# EAGLE schematic motor (EAGLE 4.16)
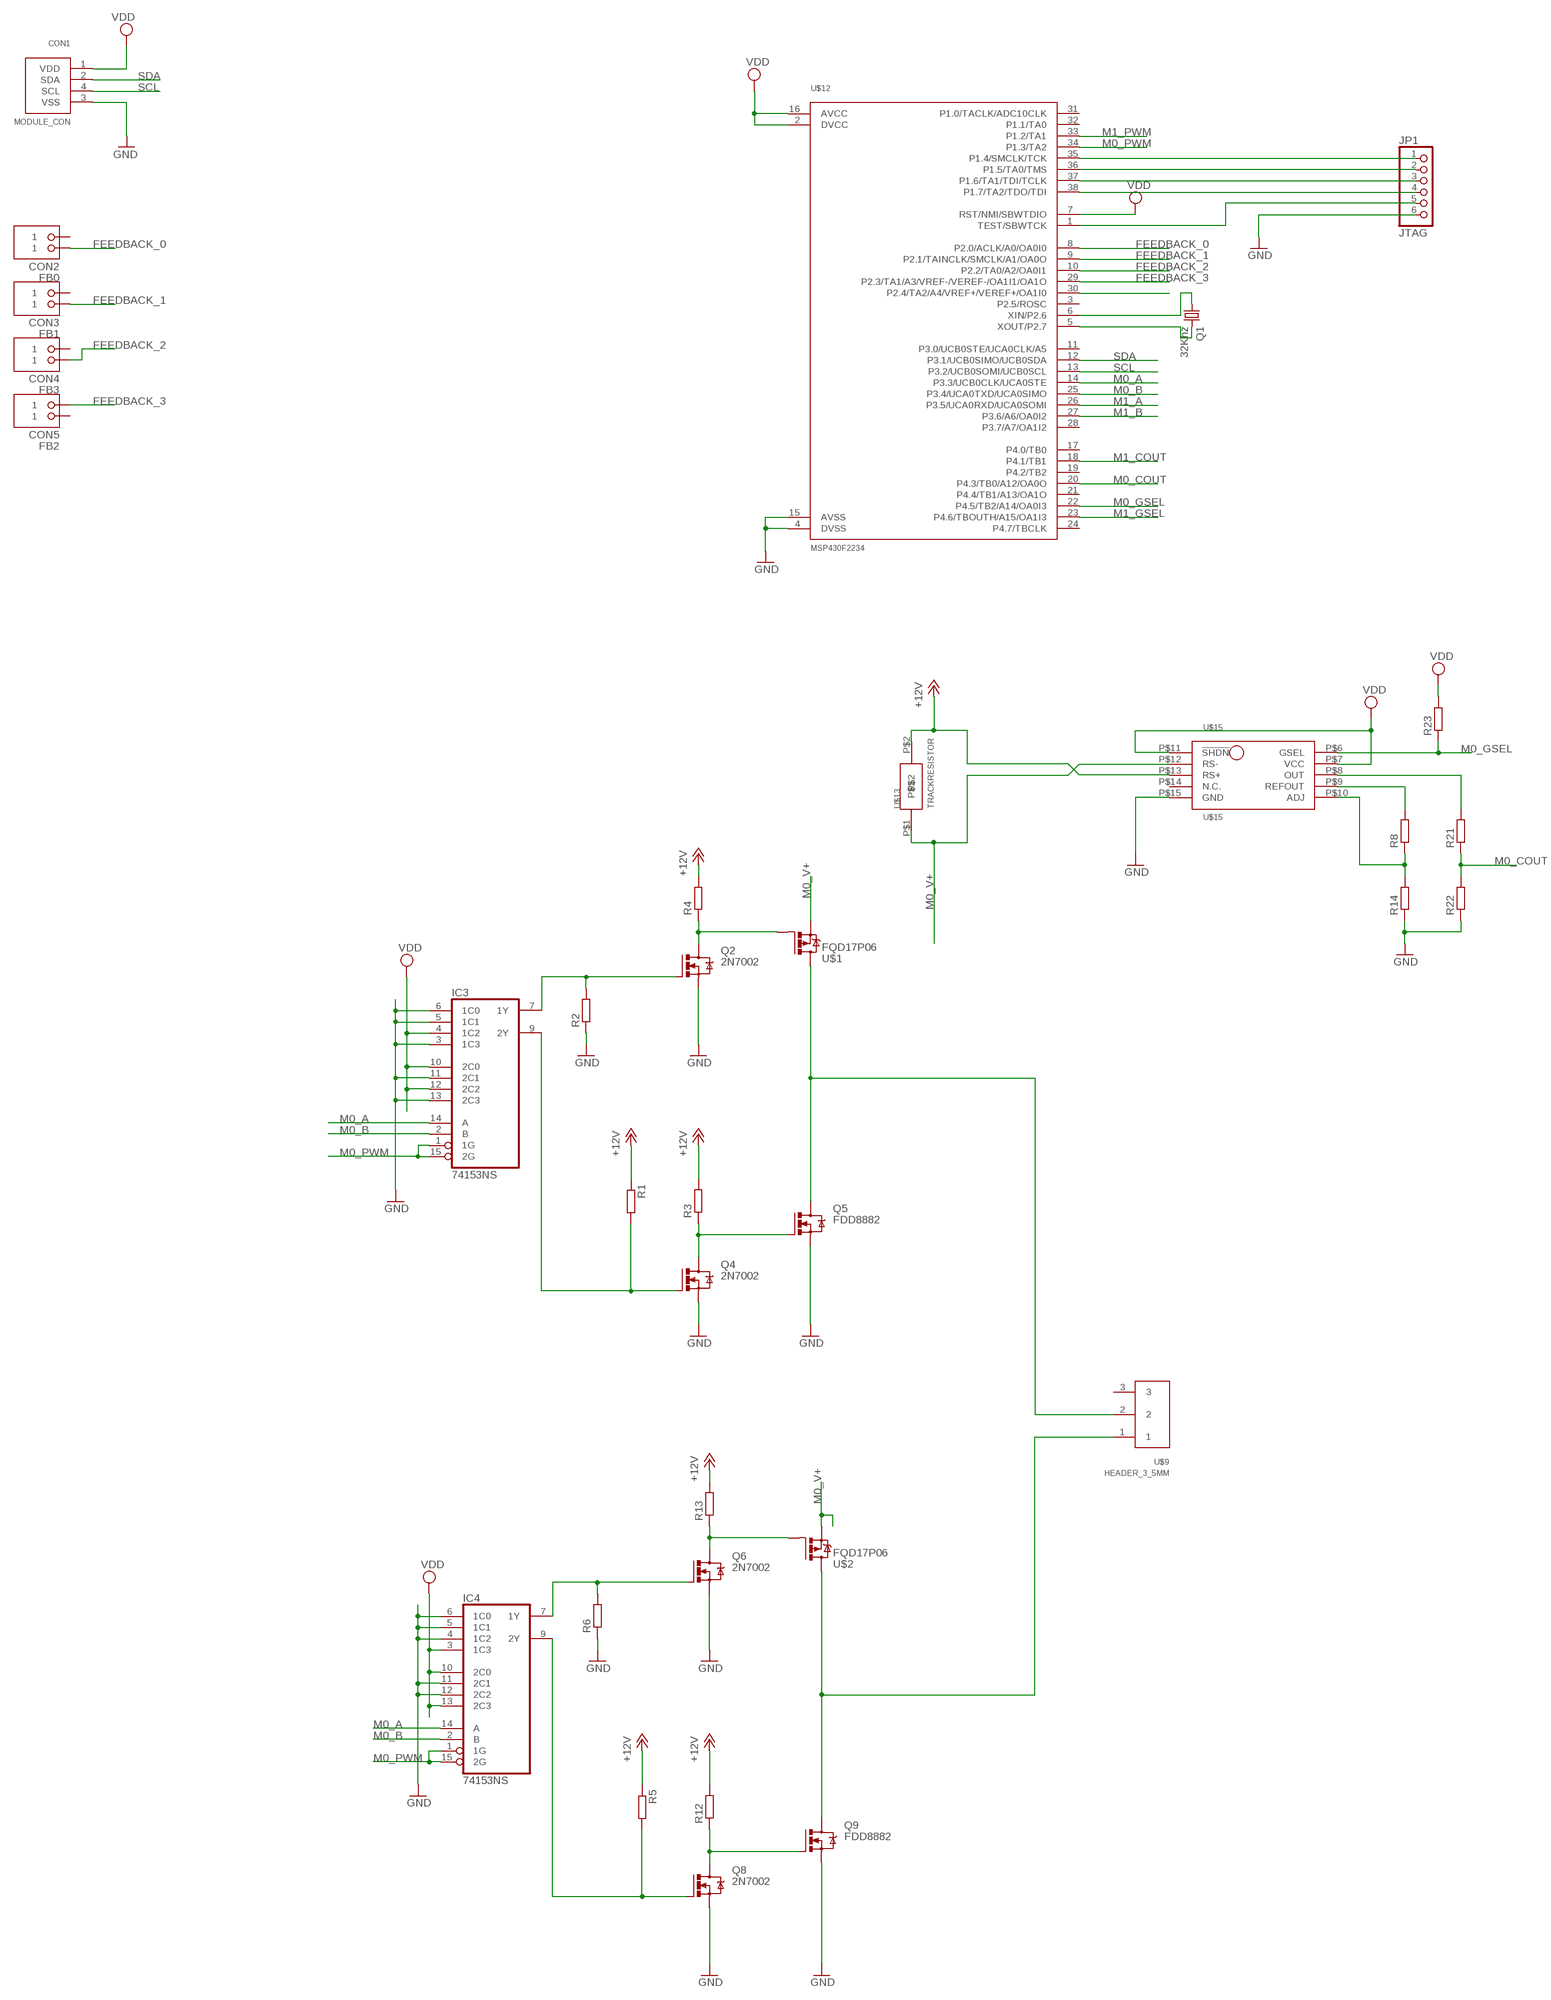
[diagram p0: schematic, sheet 1, part 1 of 2]
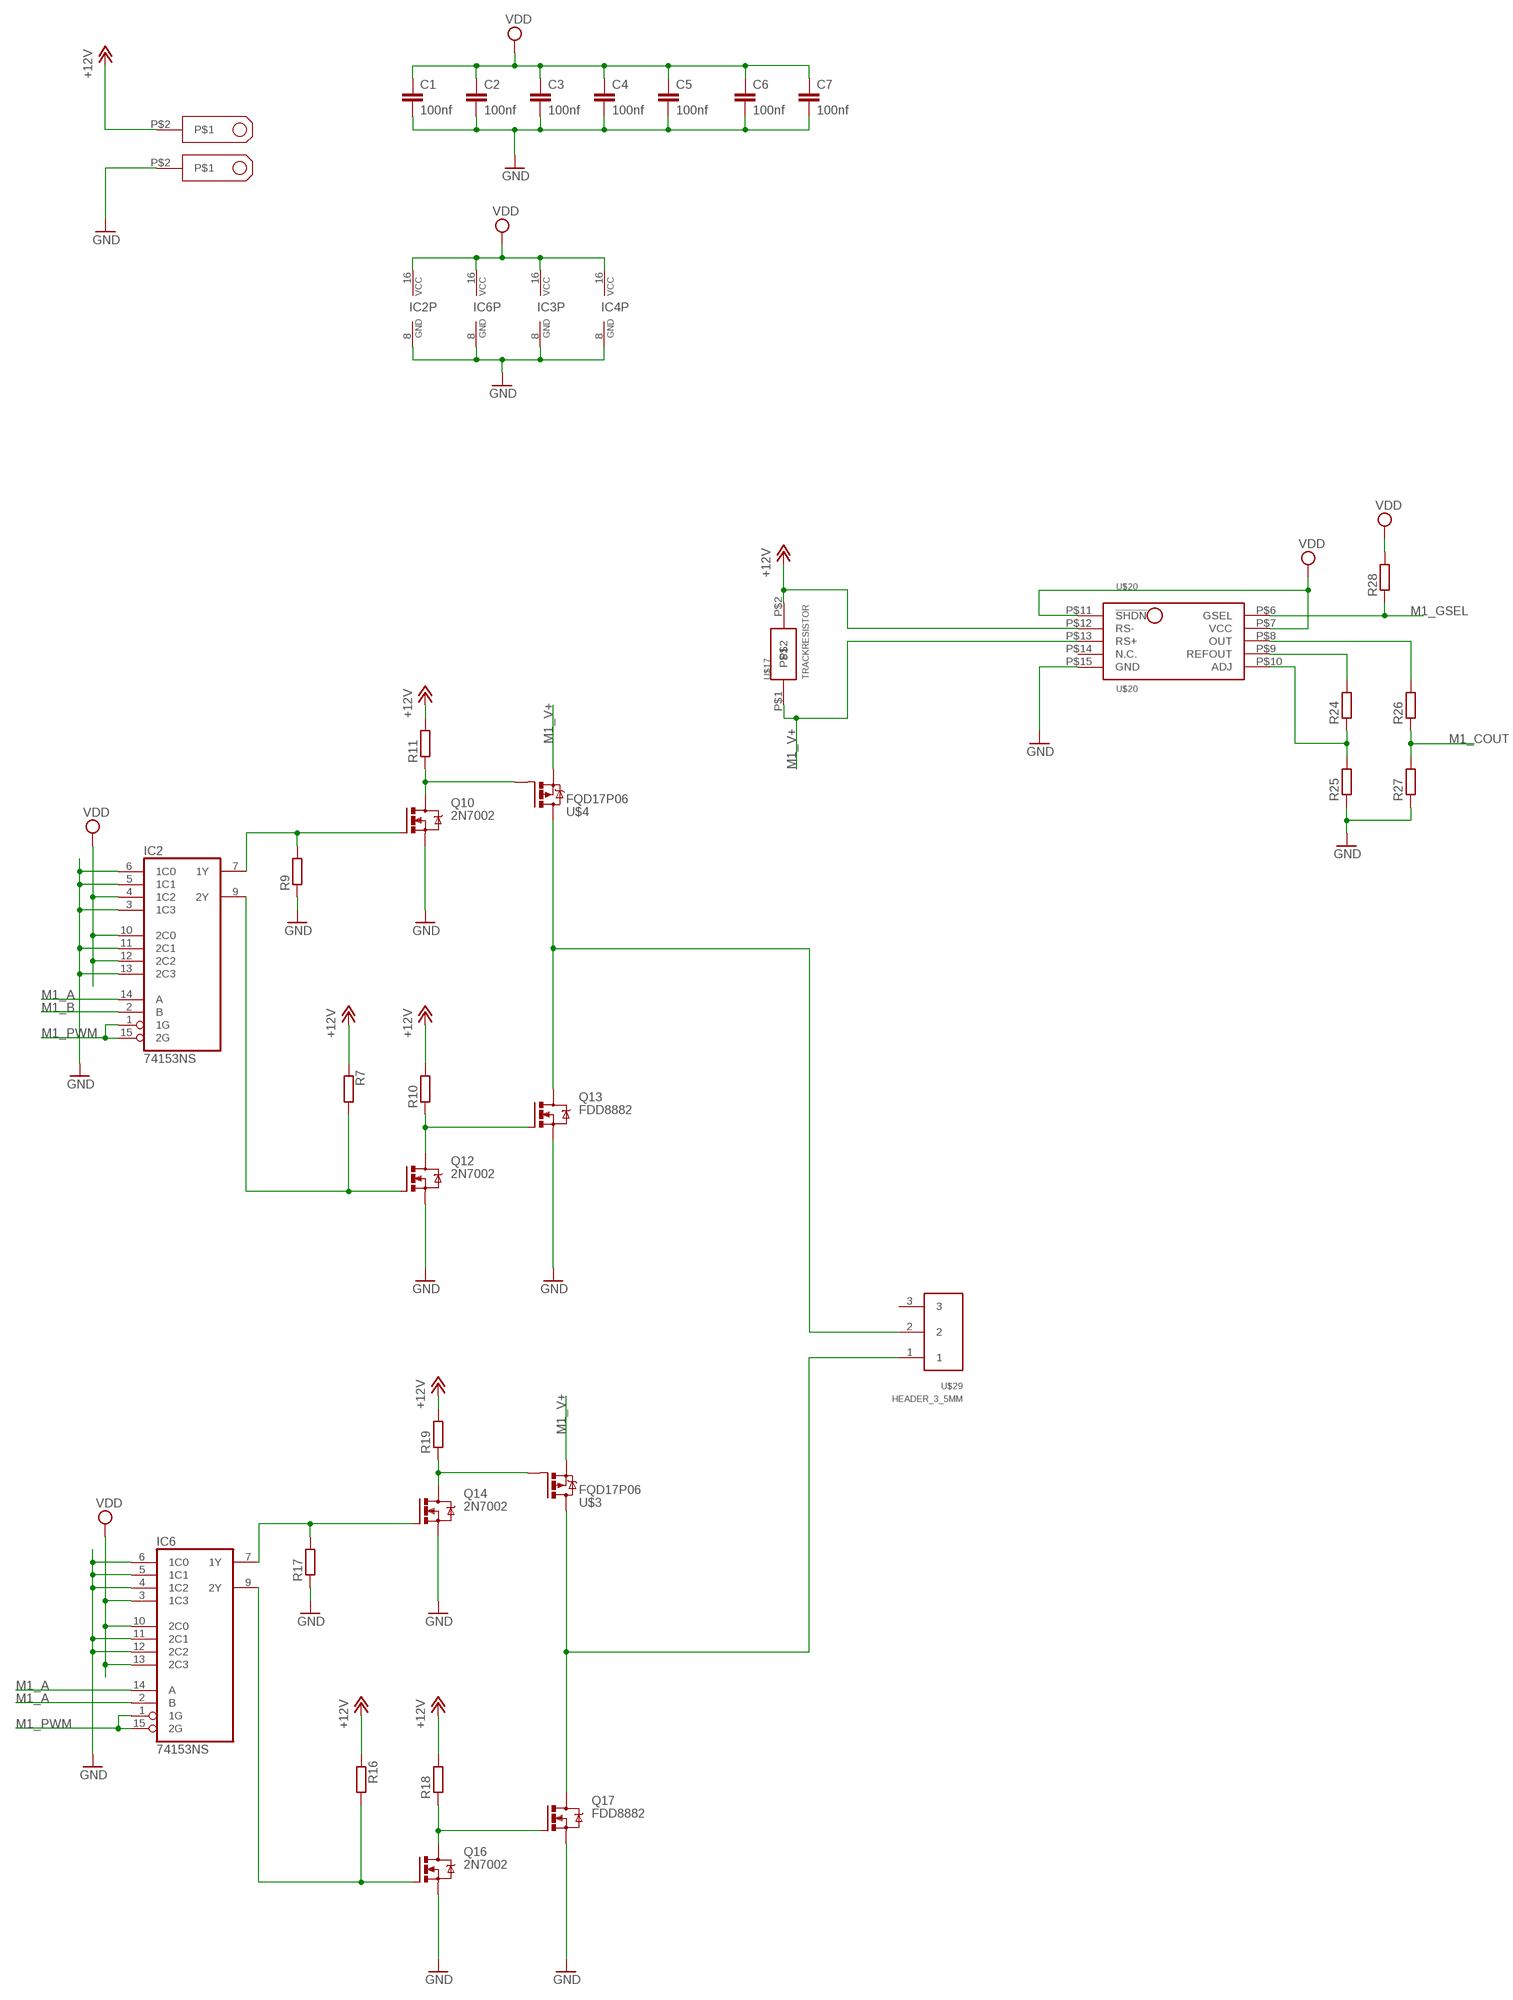
[diagram p1: schematic, sheet 1, part 2 of 2]

## Parts
C1  100nf  C-0603  [C0603]
C2  100nf  C-0603  [C0603]
C3  100nf  C-0603  [C0603]
C4  100nf  C-0603  [C0603]
C5  100nf  C-0603  [C0603]
C6  100nf  C-0603  [C0603]
C7  100nf  C-0603  [C0603]
CON1  MODULE_CON  [RJ11]
CON2  FB0  CAGECLAMP  [CAGECLAMP]
CON3  FB1  CAGECLAMP  [CAGECLAMP]
CON4  FB3  CAGECLAMP  [CAGECLAMP]
CON5  FB2  CAGECLAMP  [CAGECLAMP]
IC2  74153NS  [SOP16]
IC3  74153NS  [SOP16]
IC4  74153NS  [SOP16]
IC6  74153NS  [SOP16]
JP1  JTAG  PINHD-1X6  [1X06]
Q1  32Khz  CRYSTALTC26H  [TC26H]
Q2  2N7002  [SOT23]
Q4  2N7002  [SOT23]
Q5  FDD8882  [TO252-3]
Q6  2N7002  [SOT23]
Q8  2N7002  [SOT23]
Q9  FDD8882  [TO252-3]
Q10  2N7002  [SOT23]
Q12  2N7002  [SOT23]
Q13  FDD8882  [TO252-3]
Q14  2N7002  [SOT23]
Q16  2N7002  [SOT23]
Q17  FDD8882  [TO252-3]
R1  R-R1206  [R1206]
R2  R-R1206  [R1206]
R3  R-R1206  [R1206]
R4  R-R1206  [R1206]
R5  R-R1206  [R1206]
R6  R-R1206  [R1206]
R7  R-R1206  [R1206]
R8  R-EU_M1206  [M1206]
R9  R-R1206  [R1206]
R10  R-R1206  [R1206]
R11  R-R1206  [R1206]
R12  R-R1206  [R1206]
R13  R-R1206  [R1206]
R14  R-EU_M1206  [M1206]
R16  R-R1206  [R1206]
R17  R-R1206  [R1206]
R18  R-R1206  [R1206]
R19  R-R1206  [R1206]
R21  R-EU_M1206  [M1206]
R22  R-EU_M1206  [M1206]
R23  R-EU_M1206  [M1206]
R24  R-EU_M1206  [M1206]
R25  R-EU_M1206  [M1206]
R26  R-EU_M1206  [M1206]
R27  R-EU_M1206  [M1206]
R28  R-EU_M1206  [M1206]
U$1  FQD17P06  [TO252-3]
U$2  FQD17P06  [TO252-3]
U$3  FQD17P06  [TO252-3]
U$4  FQD17P06  [TO252-3]
U$9  HEADER_3_5MM  [HEADER_5MM_3]
U$10  6.3X0.8-SPADE  [SPADE]
U$11  6.3X0.8-SPADE  [SPADE]
U$12  MSP430F2234  [TSSOP38]
U$13  TRACKRESISTOR  [TRACK-RESISTOR]
U$15  MAX4069  [UMAX]
U$17  TRACKRESISTOR  [TRACK-RESISTOR]
U$20  MAX4069  [UMAX]
U$29  HEADER_3_5MM  [HEADER_5MM_3]

## Nets
+12V: R1.1 R3.2 R4.2 R5.1 R7.1 R10.2 R11.2 R12.2 R13.2 R16.1 R18.2 R19.2 U$10.P$2 U$13.P$2 U$15.P$13(RS+) U$17.P$2 U$20.P$12(RS-)
FEEDBACK_0: CON2.2 U$12.8(P2.0/ACLK/A0/OA0I0)
FEEDBACK_1: CON3.2 U$12.9(P2.1/TAINCLK/SMCLK/A1/OA0O)
FEEDBACK_2: CON4.2 U$12.10(P2.2/TA0/A2/OA0I1)
FEEDBACK_3: CON5.1 U$12.29(P2.3/TA1/A3/VREF-/VEREF-/OA1I1/OA1O)
GND: C1.2 C2.2 C3.2 C4.2 C5.2 C6.2 C7.2 CON1.3(VSS) IC2.3(1C3) IC2.5(1C1) IC2.6(1C0) IC2.8(GND) IC2.11(2C1) IC2.13(2C3) IC3.3(1C3) IC3.5(1C1) IC3.6(1C0) IC3.8(GND) IC3.11(2C1) IC3.13(2C3) IC4.4(1C2) IC4.5(1C1) IC4.6(1C0) IC4.8(GND) IC4.11(2C1) IC4.12(2C2) IC6.4(1C2) IC6.5(1C1) IC6.6(1C0) IC6.8(GND) IC6.11(2C1) IC6.12(2C2) JP1.6 Q2.2(S) Q4.2(S) Q5.3(S) Q6.2(S) Q8.2(S) Q9.3(S) Q10.2(S) Q12.2(S) Q13.3(S) Q14.2(S) Q16.2(S) Q17.3(S) R2.1 R6.1 R9.1 R14.1 R17.1 R22.1 R25.1 R27.1 U$11.P$2 U$12.4(DVSS) U$12.15(AVSS) U$15.P$15(GND) U$20.P$15(GND)
M0_A: IC3.14(A) IC4.14(A) U$12.14(P3.3/UCB0CLK/UCA0STE)
M0_B: IC3.2(B) IC4.2(B) U$12.25(P3.4/UCA0TXD/UCA0SIMO)
M0_COUT: R21.1 R22.2 U$12.20(P4.3/TB0/A12/OA0O)
M0_GSEL: R23.1 U$12.22(P4.5/TB2/A14/OA0I3) U$15.P$6(GSEL)
M0_PWM: IC3.1(1G) IC3.15(2G) IC4.1(1G) IC4.15(2G) U$12.34(P1.3/TA2)
M0_V+: U$1.3(S) U$2.3(S) U$13.P$1 U$15.P$12(RS-)
M1_A: IC2.14(A) IC6.2(B) IC6.14(A) U$12.26(P3.5/UCA0RXD/UCA0SOMI)
M1_B: IC2.2(B) U$12.27(P3.6/A6/OA0I2)
M1_COUT: R26.1 R27.2 U$12.18(P4.1/TB1)
M1_GSEL: R28.1 U$12.23(P4.6/TBOUTH/A15/OA1I3) U$20.P$6(GSEL)
M1_PWM: IC2.1(1G) IC2.15(2G) IC6.1(1G) IC6.15(2G) U$12.33(P1.2/TA1)
M1_V+: U$3.3(S) U$4.3(S) U$17.P$1 U$20.P$13(RS+)
N$1: JP1.1 U$12.35(P1.4/SMCLK/TCK)
N$2: JP1.2 U$12.36(P1.5/TA0/TMS)
N$3: Q5.2(D) U$1.2(D) U$9.2
N$4: Q1.1 U$12.6(XIN/P2.6)
N$5: Q2.3(D) R4.1 U$1.1(G)
N$6: Q4.3(D) Q5.1(G) R3.1
N$7: JP1.3 U$12.37(P1.6/TA1/TDI/TCLK)
N$8: IC3.7(1Y) Q2.1(G) R2.2
N$9: JP1.4 U$12.38(P1.7/TA2/TDO/TDI)
N$10: JP1.5 U$12.1(TEST/SBWTCK)
N$11: Q17.2(D) U$3.2(D) U$29.1
N$12: Q13.2(D) U$4.2(D) U$29.2
N$13: IC3.9(2Y) Q4.1(G) R1.2
N$14: Q9.2(D) U$2.2(D) U$9.1
N$15: Q6.3(D) R13.1 U$2.1(G)
N$16: Q8.3(D) Q9.1(G) R12.1
N$17: IC4.7(1Y) Q6.1(G) R6.2
N$18: IC4.9(2Y) Q8.1(G) R5.2
N$19: Q1.2 U$12.5(XOUT/P2.7)
N$23: R21.2 U$15.P$8(OUT)
N$25: R8.2 U$15.P$9(REFOUT)
N$26: Q10.3(D) R11.1 U$4.1(G)
N$27: Q12.3(D) Q13.1(G) R10.1
N$28: R8.1 R14.2 U$15.P$10(ADJ)
N$29: IC2.7(1Y) Q10.1(G) R9.2
N$30: IC2.9(2Y) Q12.1(G) R7.2
N$32: R24.2 U$20.P$9(REFOUT)
N$33: R24.1 R25.2 U$20.P$10(ADJ)
N$34: R26.2 U$20.P$8(OUT)
N$37: Q14.3(D) R19.1 U$3.1(G)
N$38: Q16.3(D) Q17.1(G) R18.1
N$39: IC6.7(1Y) Q14.1(G) R17.2
N$40: IC6.9(2Y) Q16.1(G) R16.2
N$46: U$12.30(P2.4/TA2/A4/VREF+/VEREF+/OA1I0)
SCL: CON1.4(SCL) U$12.13(P3.2/UCB0SOMI/UCB0SCL)
SDA: CON1.2(SDA) U$12.12(P3.1/UCB0SIMO/UCB0SDA)
VDD: C1.1 C2.1 C3.1 C4.1 C5.1 C6.1 C7.1 CON1.1(VDD) IC2.4(1C2) IC2.10(2C0) IC2.12(2C2) IC2.16(VCC) IC3.4(1C2) IC3.10(2C0) IC3.12(2C2) IC3.16(VCC) IC4.3(1C3) IC4.10(2C0) IC4.13(2C3) IC4.16(VCC) IC6.3(1C3) IC6.10(2C0) IC6.13(2C3) IC6.16(VCC) R23.2 R28.2 U$12.2(DVCC) U$12.7(RST/NMI/SBWTDIO) U$12.16(AVCC) U$15.P$7(VCC) U$15.P$11(!SHDN) U$20.P$7(VCC) U$20.P$11(!SHDN)
Unconnected: CON2.1 CON3.1 CON4.1 CON5.2 U$9.3 U$12.3(P2.5/ROSC) U$12.11(P3.0/UCB0STE/UCA0CLK/A5) U$12.17(P4.0/TB0) U$12.19(P4.2/TB2) U$12.21(P4.4/TB1/A13/OA1O) U$12.24(P4.7/TBCLK) U$12.28(P3.7/A7/OA1I2) U$12.31(P1.0/TACLK/ADC10CLK) U$12.32(P1.1/TA0) U$29.3

## Power pins joined to a net without a drawn wire
N.C.: U$15.P$14(N.C.) U$20.P$14(N.C.)

## Library data of the parts
C1-C7 = quantum-sensor:C: Capacitor
CON1 = ecssr:MODULE_CON
CON2-CON5 = ecssr:CAGECLAMP
IC2-IC4 IC6 = ecssr:74*153: Dual 4-line to 1-line data SELECTOR/MULTIPLEXER
JP1 = pinhead:PINHD-1X6: PIN HEADER
Q1 = crystal:CRYSTAL: CRYSTAL
Q2 Q4 Q6 Q8 Q10 Q12 Q14 Q16 = ecssr:2N7002
Q5 Q9 Q13 Q17 = ecssr:FDD8882
R1-R7 R9-R13 R16-R19 = quantum-sensor:R: Resistor
R8 R14 R21-R28 = rcl:R-EU_: RESISTOR, European symbol
U$1-U$4 = ecssr:FQD17P06
U$9 U$29 = ecssr:HEADER_3
U$10 U$11 = ecssr-Pwr:6.3X0.8-SPADE
U$12 = ecssr:MSP430F2234
U$13 U$17 = ecssr-Pwr:TRACKRESISTOR
U$15 U$20 = ecssr-Pwr:MAX4069